# EAGLE design main_board (EAGLE 5.10)
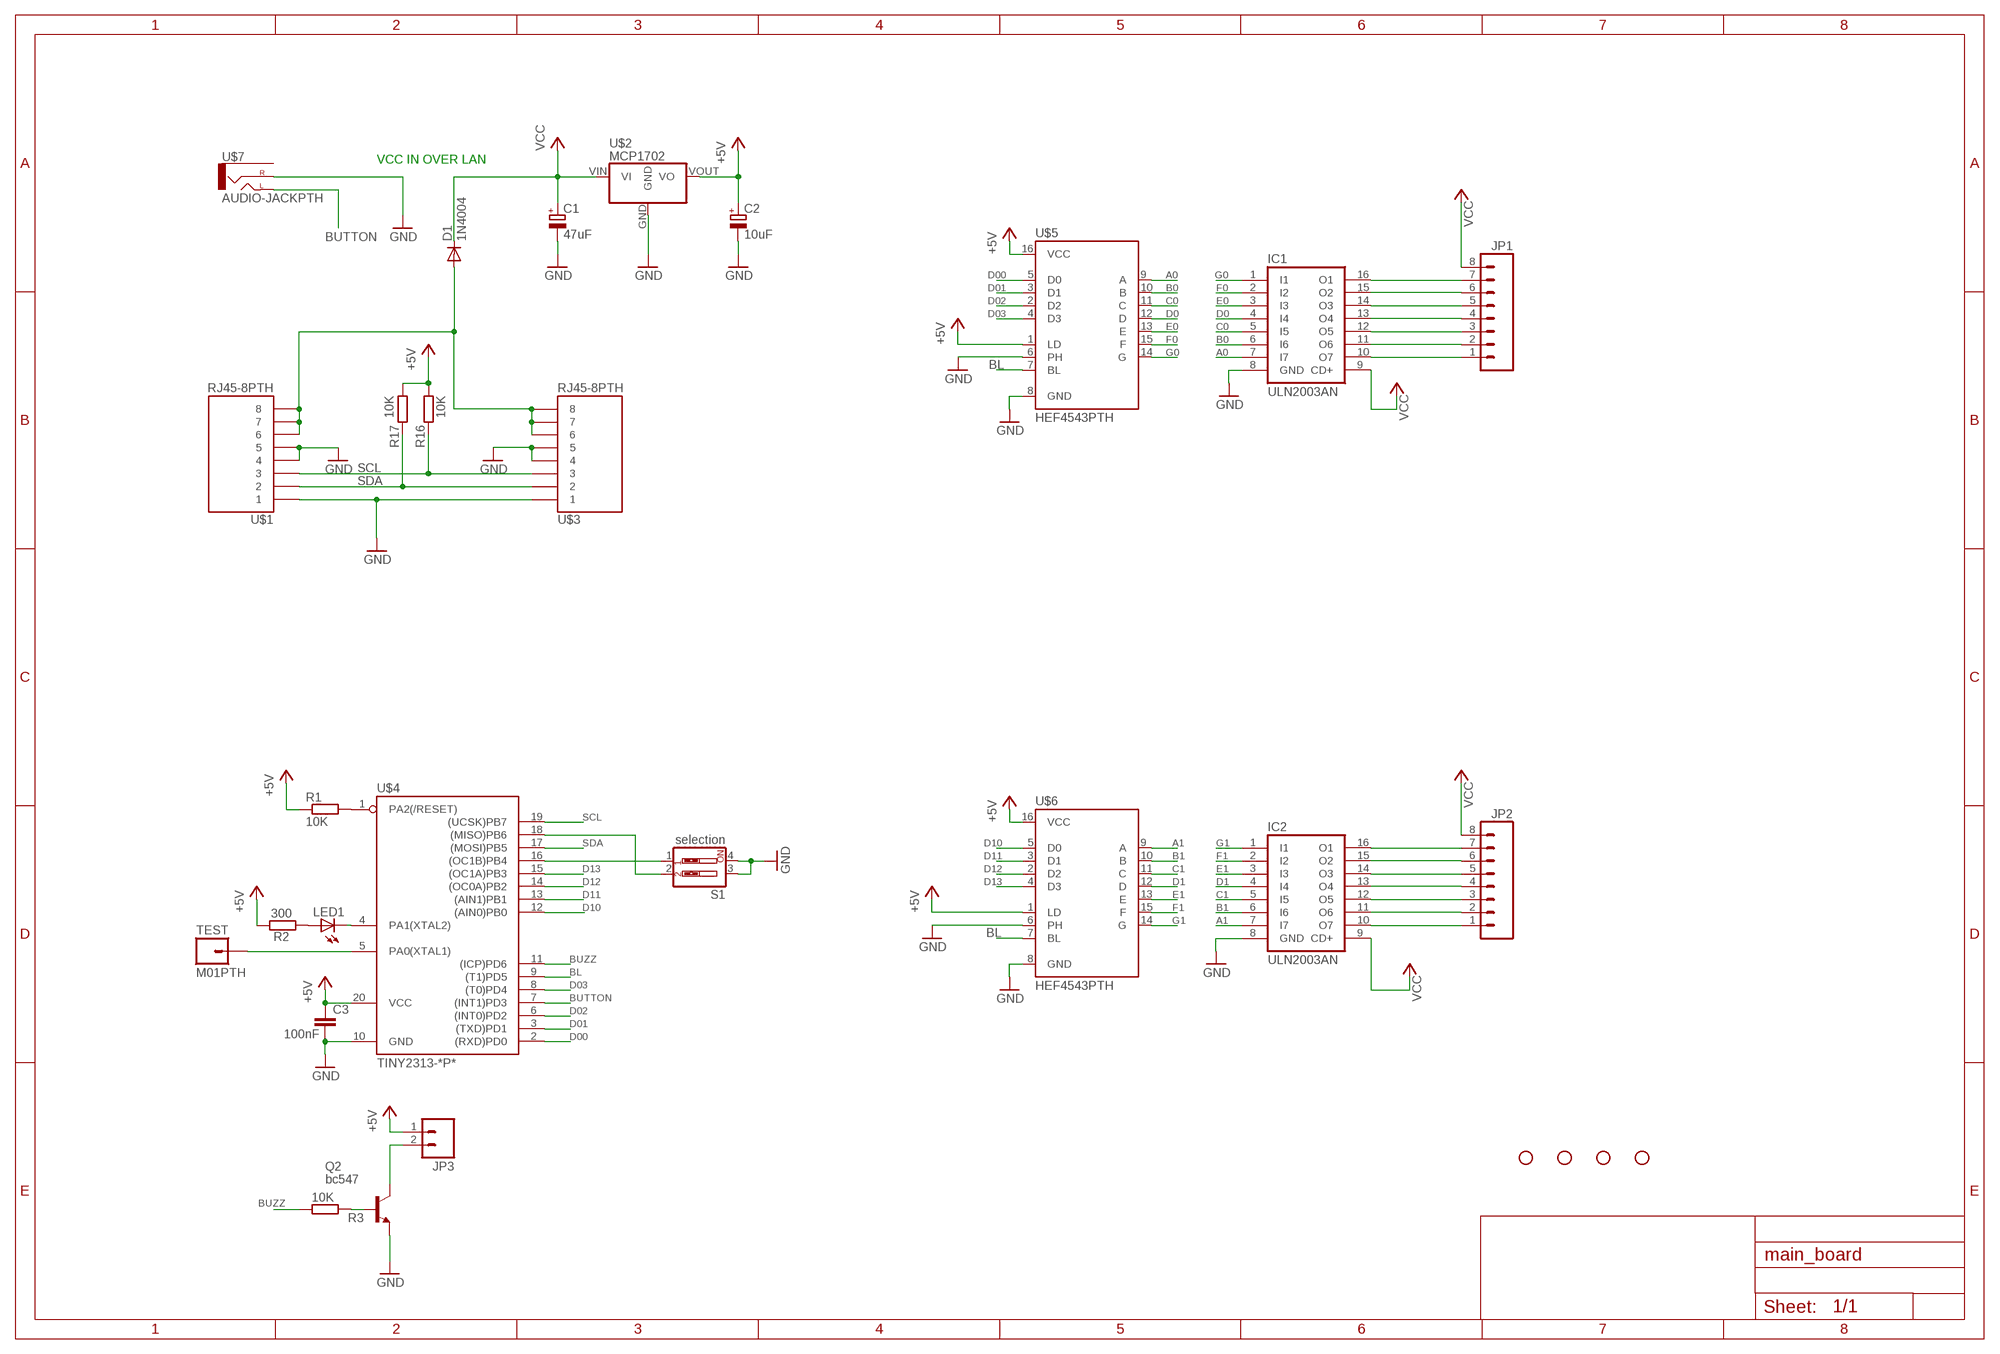
[diagram p0: schematic, sheet 1]

## Parts
C1  47uF  CPOL-EUE2-5  [E2-5]
C2  10uF  CPOL-EUE2-5  [E2-5]
C3  100nF  C-EU025-024X044  [C025-024X044]
D1  1N4004  [DO41-10]
IC1  ULN2003AN  [DIL16]
IC2  ULN2003AN  [DIL16]
JP1  M08  [1X08]
JP2  M08  [1X08]
JP3  M02  [1X02_LONGPADS]
JP4  STAND-OFF  [STAND-OFF]
JP5  STAND-OFF  [STAND-OFF]
JP6  STAND-OFF  [STAND-OFF]
JP7  STAND-OFF  [STAND-OFF]
LED1  LED5MM  [LED5MM]
Q2  bc547  BC547  [TO92]
R1  10K  R-EU_0207/7  [0207/7]
R2  300  R-EU_0207/7  [0207/7]
R3  10K  R-EU_0207/7  [0207/7]
R16  10K  R-EU_0207/7  [0207/7]
R17  10K  R-EU_0207/7  [0207/7]
S1  selection  SW_DIP-2  [DIPSWITCH-02]
TEST  M01PTH  [1X01]
U$1  RJ45-8PTH  [RJ45-8]
U$2  MCP1702  [TO-92-3]
U$3  RJ45-8PTH  [RJ45-8]
U$4  TINY2313-*P*  [DIL20]
U$5  HEF4543PTH  [DIL16]
U$6  HEF4543PTH  [DIL16]
U$7  AUDIO-JACKPTH  [AUDIO-JACK]

## Nets
+5V [power]: C2.+ C3.1 JP3.1 R1.1 R2.1 R16.2 R17.1 U$2.VOUT(VO) U$4.20(VCC) U$5.1(LD) U$5.16(VCC) U$6.1(LD) U$6.16(VCC)
A0: IC1.7(I7) U$5.9(A)
A1: IC2.7(I7) U$6.9(A)
B0: IC1.6(I6) U$5.10(B)
B1: IC2.6(I6) U$6.10(B)
BL: U$4.9((T1)PD5) U$5.7(BL) U$6.7(BL)
BUTTON [communication]: U$4.7((INT1)PD3) U$7.TIP(LEFT)
BUZZ: R3.2 U$4.11((ICP)PD6)
C0: IC1.5(I5) U$5.11(C)
C1: IC2.5(I5) U$6.11(C)
D00 [power]: U$4.2((RXD)PD0) U$5.5(D0)
D0: IC1.4(I4) U$5.12(D)
D01 [power]: U$4.3((TXD)PD1) U$5.3(D1)
D1: IC2.4(I4) U$6.12(D)
D02 [power]: U$4.6((INT0)PD2) U$5.2(D2)
D03 [power]: U$4.8((T0)PD4) U$5.4(D3)
D10 [power]: U$4.12((AIN0)PB0) U$6.5(D0)
D11 [power]: U$4.13((AIN1)PB1) U$6.3(D1)
D12 [power]: U$4.14((OC0A)PB2) U$6.2(D2)
D13 [power]: U$4.15((OC1A)PB3) U$6.4(D3)
E0: IC1.3(I3) U$5.13(E)
E1: IC2.3(I3) U$6.13(E)
F0: IC1.2(I2) U$5.15(F)
F1: IC2.2(I2) U$6.15(F)
G0: IC1.1(I1) U$5.14(G)
G1: IC2.1(I1) U$6.14(G)
GND [power]: C1.- C2.- C3.2 IC1.8(GND) IC2.8(GND) Q2.1(E) S1.3 S1.4 U$1.1 U$1.4 U$1.5 U$2.GND U$3.1 U$3.4 U$3.5 U$4.10(GND) U$5.6(PH) U$5.8(GND) U$6.6(PH) U$6.8(GND) U$7.RING(RIGHT)
N$1: LED1.K(C) U$4.4(PA1(XTAL2))
N$2: D1.A U$1.6 U$1.7 U$1.8 U$3.6 U$3.7 U$3.8
N$3: TEST.1 U$4.5(PA0(XTAL1))
N$4: LED1.A R2.2
N$5: R1.2 U$4.1(PA2(/RESET))
N$6: S1.1 U$4.16((OC1B)PB4)
N$7: S1.2 U$4.18((MISO)PB6)
N$20: IC1.16(O1) JP1.7
N$21: IC1.15(O2) JP1.6
N$22: IC1.14(O3) JP1.5
N$23: IC1.13(O4) JP1.4
N$24: IC1.12(O5) JP1.3
N$25: IC1.11(O6) JP1.2
N$26: IC1.10(O7) JP1.1
N$27: IC2.16(O1) JP2.7
N$28: IC2.15(O2) JP2.6
N$29: IC2.14(O3) JP2.5
N$30: IC2.13(O4) JP2.4
N$31: IC2.12(O5) JP2.3
N$32: IC2.11(O6) JP2.2
N$33: IC2.10(O7) JP2.1
N$34 [power]: JP3.2 Q2.3(C)
N$36: Q2.2(B) R3.1
SCL [communication]: R16.1 U$1.3 U$3.3 U$4.19((UCSK)PB7)
SDA [communication]: R17.2 U$1.2 U$3.2 U$4.17((MOSI)PB5)
VCC [power]: C1.+ D1.C IC1.9(CD+) IC2.9(CD+) JP1.8 JP2.8 U$2.VIN(VI)
Unconnected: U$7.SLEEVE

## Notes on the sheet
- VCC IN OVER LAN

## Library data of the parts
C1 C2 = rcl:CPOL-EU: POLARIZED CAPACITOR, European symbol
C3 = rcl:C-EU: CAPACITOR, European symbol
D1 = diode:1N4004: DIODE general purpose rectifier, 1 A
IC1 IC2 = uln-udn:ULN2003A: DRIVER ARRAY
JP1 JP2 = SparkFun:M08: Header 8 Standard 8-pin 0.1" header. Use with straight break away headers (SKU : PRT-00116), right angle break away headers (PRT-00553), swiss pins (PRT-00743), machine pins (PRT-00117), and female headers (PRT-00115).
JP3 = SparkFun:M02: Header 2 Standard 2-pin 0.1" header. Use with straight break away headers (SKU : PRT-00116), right angle break away headers (PRT-00553), swiss pins (PRT-00743), machine pins (PRT-00117), and female headers (PRT-00115). Molex polarized connector foot print use with SKU : PRT-08233 with associated crimp pins and housings.
JP4-JP7 = SparkFun:STAND-OFF: Stand Off This is the mechanical footprint for a #4 phillips button head screw. Use the keepout ring to avoid running the screw head into surrounding components. SKU : PRT-00447
LED1 = led:LED: LED OSRAM: - CHIPLED LG R971, LG N971, LY N971, LG Q971, LY Q971, LO R971, LY R971 LH N974, LH R974 LS Q976, LO Q976, LY Q976 LO Q996 - Hyper CHIPLED LW Q18S LB Q993, LB Q99A, LB R99A - SideLED LS A670, LO A670, LY A670, LG A670, LP A670 LB A673, LV A673, LT A673, LW A673 LH A674 LY A675 LS A676, LA A676, LO A676, LY A676, LW A676 LS A679, LY A679, LG A679 - Hyper Micro SIDELED® LS Y876, LA Y876, LO Y876, LY Y876 LT Y87S - SmartLED LW L88C, LW L88S LB L89C, LB L89S, LG L890 LS L89K, LO L89K, LY L89K LS L896, LA L896, LO L896, LY L896 - TOPLED LS T670, LO T670, LY T670, LG T670, LP T670 LSG T670, LSP T670, LSY T670, LOP T670, LYG T670 LG T671, LOG T671, LSG T671 LB T673, LV T673, LT T673, LW T673 LH T674 LS T676, LA T676, LO T676, LY T676, LB T676, LH T676, LSB T676, LW T676 LB T67C, LV T67C, LT T67C, LS T67K, LO T67K, LY T67K, LW E67C LS E67B, LA E67B, LO E67B, LY E67B, LB E67C, LV E67C, LT E67C LW T67C LS T679, LY T679, LG T679 LS T770, LO T770, LY T770, LG T770, LP T770 LB T773, LV T773, LT T773, LW T773 LH T774 LS E675, LA E675, LY E675, LS T675 LS T776, LA T776, LO T776, LY T776, LB T776 LHGB T686 LT T68C, LB T68C - Hyper Mini TOPLED® LB M676 - Mini TOPLED Santana® LG M470 LS M47K, LO M47K, LY M47K Source: http://www.osram.convergy.de LUXEON: - LUMILED® LXK2-PW12-R00, LXK2-PW12-S00, LXK2-PW14-U00, LXK2-PW14-V00 LXK2-PM12-R00, LXK2-PM12-S00, LXK2-PM14-U00 LXK2-PE12-Q00, LXK2-PE12-R00, LXK2-PE12-S00, LXK2-PE14-T00, LXK2-PE14-U00 LXK2-PB12-K00, LXK2-PB12-L00, LXK2-PB12-M00, LXK2-PB14-N00, LXK2-PB14-P00, LXK2-PB14-Q00 LXK2-PR12-L00, LXK2-PR12-M00, LXK2-PR14-Q00, LXK2-PR14-R00 LXK2-PD12-Q00, LXK2-PD12-R00, LXK2-PD12-S00 LXK2-PH12-R00, LXK2-PH12-S00 LXK2-PL12-P00, LXK2-PL12-Q00, LXK2-PL12-R00 Source: www.luxeon.com KINGBRIGHT: KA-3528ASYC Source: www.kingbright.com
Q2 = transistor:BC547: NPN TRANSISTOR
R1 = rcl:R-EU_: RESISTOR, European symbol
R2 R3 R16 R17 = resistor:R-EU_: RESISTOR, European symbol
S1 = SparkFun:SW_DIP-2: DIP SWITCH
TEST = SparkFun:M01: Header 1 Standard 1-pin 0.1" header. Use with straight break away headers (SKU : PRT-00116), right angle break away headers (PRT-00553), swiss pins (PRT-00743), machine pins (PRT-00117), and female headers (PRT-00115).
U$1 U$3 = SparkFun:RJ45-8: RJ45 Jack Simple RJ45, 8-pin connection - connector for common Cat5, Cat5e, and Cat6 Ethernet cables. Footprint not yet proven in production. Connector sku is PRT-00643; Breakout PCB sku is BOB-00716.
U$2 = my-components:MCP1702: The MCP1702 is a family of CMOS low dropout (LDO), positive voltage regulators that can deliver up to 250 mA of current while consuming only 2.0 ?A of quiescent current (typ.).
U$4 = avr-7:TINY2313*: Atmel Tiny2313 2K Flash, 128 bytes EEPROM, 128 bytes RAM
U$5 U$6 = SparkFun:HEF4543
U$7 = SparkFun:AUDIO-JACK: 3.5mm Audio Jack Simple 3.5mm common PCB mount audio jack. SKU: PRT-08032

## Net classes
1 power: width 0.406 mm, clearance 0.305 mm
2 communication: width 0.305 mm, clearance 0.305 mm

## Board
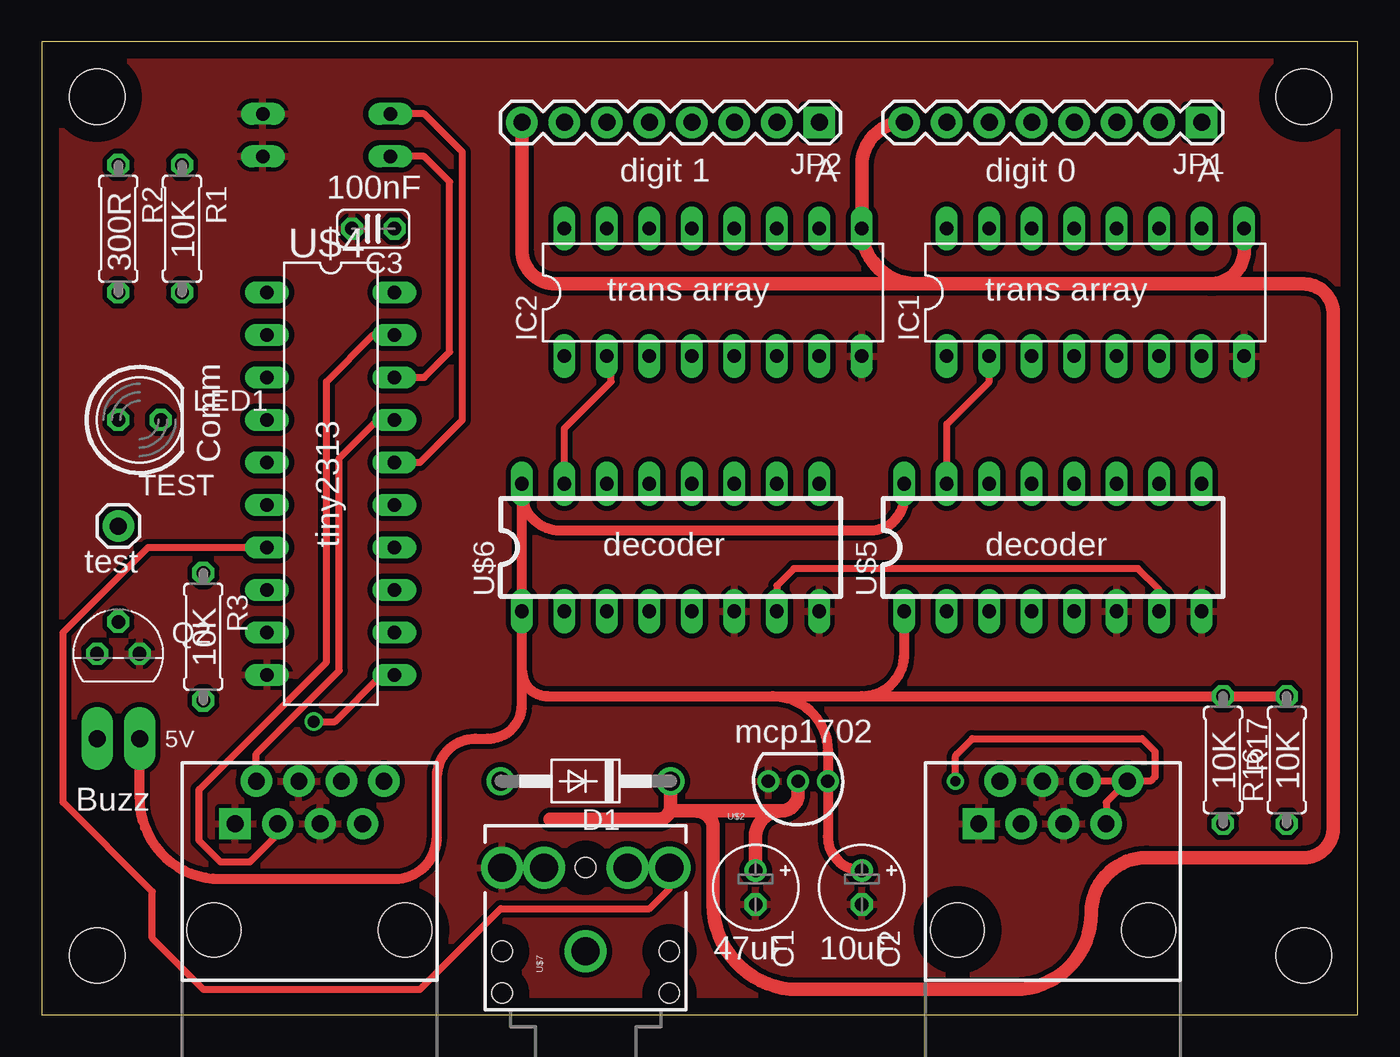
[diagram p1: board, top side]
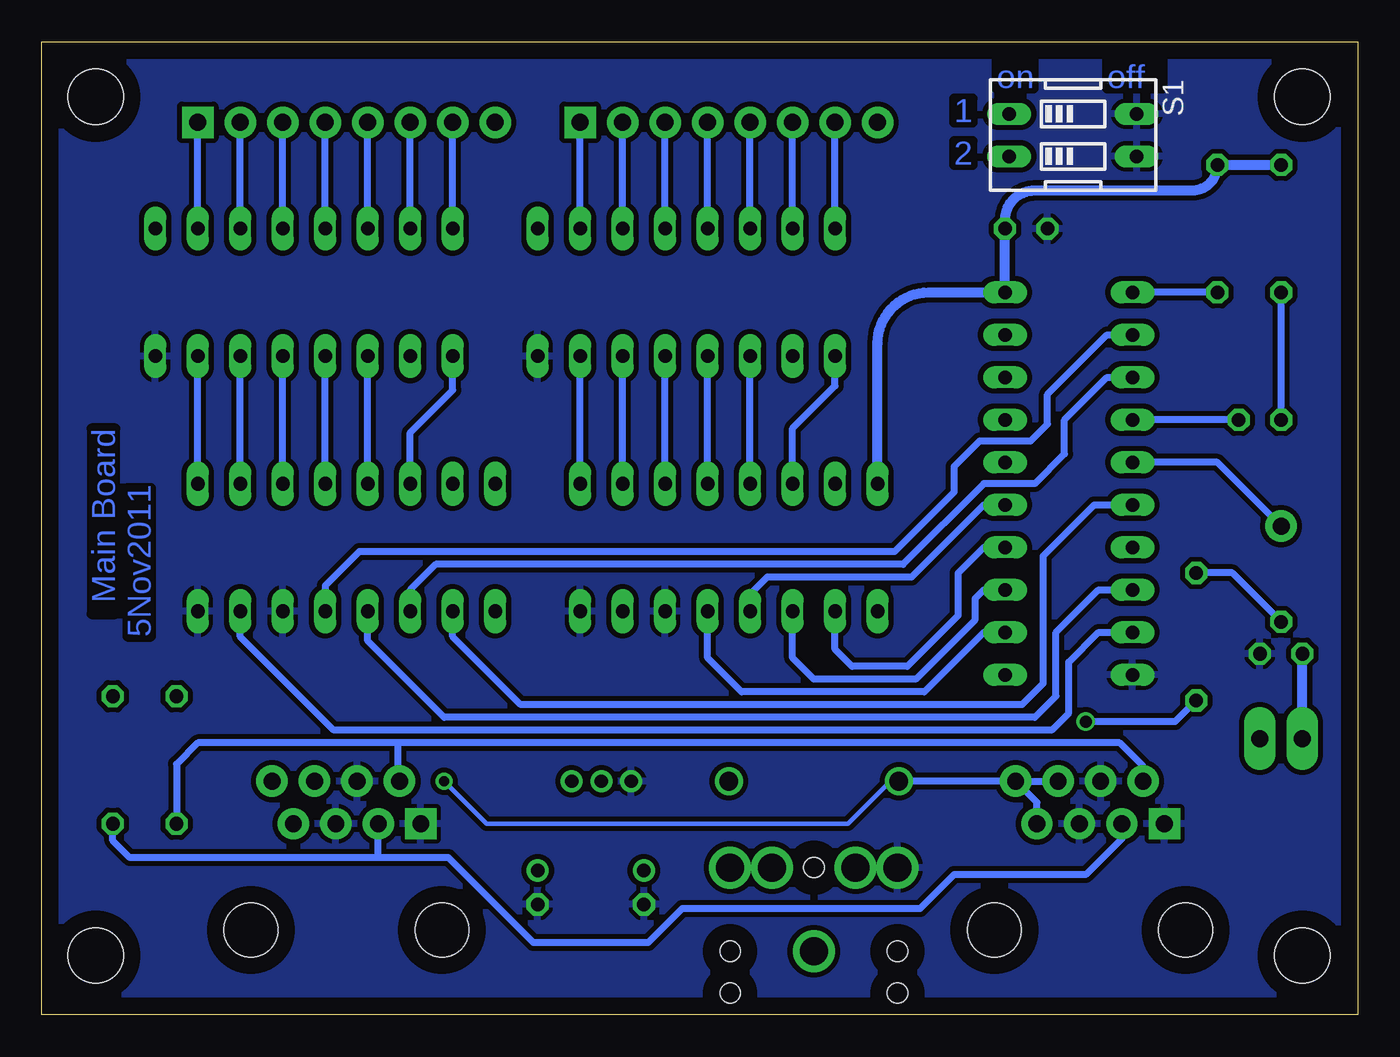
[diagram p2: board, bottom side, seen from below]

Size 78.66 x 58.16 mm. Coordinates in mm from the lower left corner, seen from the top.
Outline: 0,0 78.66,0 78.66,58.16 0,58.16 0,0
Copper layers (1*16): Top 0.035mm / dielectric 1.5mm / Bottom 0.035mm
Design rules "default *": minimum track width 10mil, minimum drill 24mil, track to track 8mil, track to pad 8mil, pad to pad 8mil, via to via 8mil, smd to smd 8mil, copper to edge 40mil, drill to drill 8mil, minimum pad ring 10mil, minimum via ring 8mil, stop-mask expansion 4mil, vias tented up to drill 0mil, thermal gap 10mil

### Footprints (pad centres in the part's own frame; a part is rotated, then mirrored left to right if it is on the bottom)
E2-5 = drill 0.813 pad 1.27 round: + -1.016,0 | drill 0.813 pad 1.27 octagon: - 1.016,0
C025-024X044 = drill 0.813 octagon: 1 -1.27,0; 2 1.27,0
DO41-10 = drill 1.118 round: A 5.08,0; C -5.08,0
DIL16 = drill 0.813 long: 1 -8.89,-3.81; 2 -6.35,-3.81; 3 -3.81,-3.81; 4 -1.27,-3.81; 5 1.27,-3.81; 6 3.81,-3.81; 7 6.35,-3.81; 8 8.89,-3.81; 9 8.89,3.81; 10 6.35,3.81; 11 3.81,3.81; 12 1.27,3.81; 13 -1.27,3.81; 14 -3.81,3.81; 15 -6.35,3.81; 16 -8.89,3.81
1X08 = drill 1.016 pad 1.88 square: 1 0,0 | drill 1.016 pad 1.88 round: 2 2.54,0; 3 5.08,0; 4 7.62,0; 5 10.16,0; 6 12.7,0; 7 15.24,0; 8 17.78,0
1X02_LONGPADS = drill 1.016 pad 1.88 long: 1 0,0; 2 2.54,0
STAND-OFF = hole 3.302: 0,0
LED5MM = drill 0.813 octagon: A -1.27,0; K 1.27,0
TO92 = drill 0.813 octagon: 1 1.27,0; 2 0,1.905; 3 -1.27,0
0207/7 = drill 0.813 octagon: 1 -3.81,0; 2 3.81,0
DIPSWITCH-02 = drill 0.813 long: 1 -1.27,-3.81; 2 1.27,-3.81; 3 1.27,3.81; 4 -1.27,3.81
1X01 = drill 1.016 pad 1.88 round: 1 0,0
RJ45-8 = drill 1 pad 1.88 square: 1 -4.445,6.35 | drill 1 pad 1.88 round: 2 -3.175,8.89; 3 -1.905,6.35; 4 -0.635,8.89; 5 0.635,6.35; 6 1.905,8.89; 7 3.175,6.35; 8 4.445,8.89 | hole 3.2: -5.715,0; 5.715,0
TO-92-3 = drill 0.8 pad 1.016 round: GND 1.778,0; VIN 0,0; VOUT -1.778,0
DIL20 = drill 0.813 long: 1 -11.43,-3.81; 2 -8.89,-3.81; 3 -6.35,-3.81; 4 -3.81,-3.81; 5 -1.27,-3.81; 6 1.27,-3.81; 7 3.81,-3.81; 8 6.35,-3.81; 9 8.89,-3.81; 10 11.43,-3.81; 11 11.43,3.81; 12 8.89,3.81; 13 6.35,3.81; 14 3.81,3.81; 15 1.27,3.81; 16 -1.27,3.81; 17 -3.81,3.81; 18 -6.35,3.81; 19 -8.89,3.81; 20 -11.43,3.81
AUDIO-JACK = drill 1.676 pad 1.93 round: RING 5,5; TIP 5,-5 | drill 1.676 pad 1.778 round: RSH 5,2.5; TSH 5,-2.5 | drill 1.676 pad 2.184 round: SLEEVE 0,0 | hole 1.2: 0,5; -2.5,5; -2.5,-5; 0,-5; 5,0

### Placement (x,y rotation side)
C1  42.67,7.62 270 top
C2  49.02,7.62 270 top
C3  19.81,46.99 180 top
D1  32.51,13.97 180 top
IC1  62.99,43.18 0 top
IC2  40.13,43.18 0 top
JP1  69.34,53.34 180 top
JP2  46.48,53.34 180 top
JP3  5.84,16.51 180 top
JP4  3.3,54.86 0 top
JP5  75.44,54.86 0 top
JP6  75.44,3.56 0 top
JP7  3.3,3.56 0 top
LED1  5.84,35.56 0 top
Q2  4.57,21.59 0 top
R1  8.38,46.99 270 top
R2  4.57,46.99 270 top
R3  9.65,22.61 270 top
R16  74.42,15.24 90 top
R17  70.61,15.24 270 top
S1  17.02,52.58 270 bottom
TEST  4.57,29.21 0 top
U$1  60.45,5.08 0 top
U$2  45.21,13.97 180 top
U$3  16,5.08 0 top
U$4  17.27,31.75 270 top
U$5  60.45,27.94 0 top
U$6  37.59,27.94 0 top
U$7  32.51,3.81 90 top

### Tracks (layer width: path | path; a pad name or v marks a point on that pad's centre or on a via)
+5V
  Top 0.61: C2.+ arc-90 46.99,10.67 U$2.VOUT 46.99,15.75 arc90 43.69,19.05 | R16.2 R17.1 49.02,19.05 | 28.7,20.57 U$6.1 28.7,31.24 | 28.7,20.57 arc90 30.23,19.05 43.69,19.05 | 43.69,19.05 49.02,19.05 | 49.02,19.05 arc90 51.56,21.59 U$5.1 | 28.7,20.57 28.7,18.54 arc-90 26.67,16.51 25.91,16.51 arc90 23.62,14.22 23.62,10.67 arc-90 21.08,8.13 10.67,8.13 arc-90 5.84,12.95 JP3.1 | 28.7,31.24 arc90 30.99,28.96 49.53,28.96 arc90 51.56,30.99 U$5.16 | 28.7,31.24 U$6.16
  Bottom 0.61: R2.1 R1.1 arc90 9.91,49.28 19.3,49.28 arc-90 21.08,47.5 C3.1 U$4.20 25.65,43.18 arc-90 28.7,40.13 U$6.16
A0
  Bottom 0.406: U$5.9 IC1.7
A1
  Bottom 0.406: U$6.9 IC2.7
B0
  Bottom 0.406: U$5.10 IC1.6
B1
  Bottom 0.406: U$6.10 IC2.6
BL
  Top 0.406: U$6.7 43.94,25.65 44.96,26.67 65.53,26.67 66.8,25.4 U$5.7
  Bottom 0.406: U$5.7 66.8,22.61 61.21,17.02 18.29,17.02 17.27,18.03 17.27,21.08 15.49,22.86 U$4.9
BUTTON
  Top 0.406: U$4.7 6.35,27.94 1.27,22.86 1.27,12.7 6.6,7.37 6.6,4.57 9.65,1.52 22.61,1.52 27.43,6.35 36.32,6.35 37.51,7.54 U$7.TIP
BUZZ  (via drill 0.7)
  Top 0.406: U$4.11 20.32,20.32 17.53,17.53 v16.26,17.53
  Bottom 0.406: v16.26,17.53 10.92,17.53 R3.2
C0
  Bottom 0.406: U$5.11 IC1.5
C1
  Bottom 0.406: U$6.11 IC2.5
D00
  Bottom 0.406: U$4.2 14.99,40.64 18.54,37.08 18.54,35.31 19.56,34.29 22.61,34.29 24.13,32.77 24.13,31.24 27.69,27.69 59.69,27.69 61.72,25.65 U$5.5
D0
  Bottom 0.406: U$5.12 IC1.4
D01
  Bottom 0.406: U$4.3 14.99,38.1 17.53,35.56 17.53,33.53 19.3,31.75 22.35,31.75 27.18,26.92 55.12,26.92 56.64,25.4 U$5.3
D1
  Bottom 0.406: U$6.12 IC2.4
D02
  Bottom 0.406: U$5.2 54.1,22.61 50.04,18.54 20.07,18.54 18.8,19.81 18.8,27.43 15.75,30.48 U$4.6
D03
  Bottom 0.406: U$5.4 59.18,22.35 54.61,17.78 19.3,17.78 18.03,19.05 18.03,22.86 15.49,25.4 U$4.8
D10
  Bottom 0.406: U$6.5 38.86,21.34 36.83,19.3 25.91,19.3 22.35,22.86 U$4.12
D11
  Bottom 0.406: U$6.3 33.78,21.34 32.51,20.07 26.42,20.07 22.86,23.62 22.86,24.89 22.35,25.4 U$4.13
D12
  Bottom 0.406: U$6.2 31.24,21.84 30.23,20.83 26.92,20.83 23.88,23.88 23.88,26.42 22.35,27.94 U$4.14
D13
  Bottom 0.406: U$4.15 22.35,30.48 26.67,26.16 35.31,26.16 36.32,25.15 U$6.4
E0
  Bottom 0.406: U$5.13 IC1.3
E1
  Bottom 0.406: U$6.13 IC2.3
F0
  Top 0.406: U$5.15 54.1,35.31 56.64,37.85 IC1.2
F1
  Top 0.406: U$6.15 31.24,35.05 34.04,37.85 34.04,39.12 IC2.2
G0
  Bottom 0.406: U$5.14 56.64,34.8 54.1,37.34 IC1.1
G1
  Bottom 0.406: U$6.14 33.78,35.05 31.24,37.59 IC2.1
GND
  pour Bottom (isolate 0.305): -5.08,68.58 91.44,68.58 91.44,-7.62 -5.08,-7.62
  pour Top: -15.24,76.2 101.6,76.2 101.6,-15.24 -15.24,-15.24
N$1
  Bottom 0.406: LED1.K U$4.4
N$2  (via drill 0.61)
  Top 0.406: v54.61,13.97 54.61,15.36 arc-45 54.7,15.59 55.63,16.51 65.79,16.51 66.55,15.75 66.55,14.22 66.29,13.97 U$1.8 | U$1.8 U$1.6 | U$1.7 63.63,12.7 U$1.8
  Bottom 0.254: v54.61,13.97 52.07,11.43 30.48,11.43 27.94,13.97 D1.A
  Bottom 0.406: U$3.8 D1.A | U$3.8 U$3.6 | U$3.7 19.18,12.7 U$3.8
N$3
  Bottom 0.406: TEST.1 8.38,33.02 U$4.5
N$4
  Bottom 0.406: LED1.A R2.2
N$5
  Bottom 0.406: R1.2 U$4.1
N$6
  Top 0.406: U$4.16 22.61,33.02 25.15,35.56 25.15,51.56 22.86,53.85 S1.1
N$7
  Top 0.406: U$4.18 22.86,38.1 24.38,39.62 24.38,49.78 22.86,51.31 S1.2
N$20
  Bottom 0.406: IC1.16 JP1.7
N$21
  Bottom 0.406: IC1.15 JP1.6
N$22
  Bottom 0.406: IC1.14 JP1.5
N$23
  Bottom 0.406: IC1.13 JP1.4
N$24
  Bottom 0.406: IC1.12 JP1.3
N$25
  Bottom 0.406: IC1.11 JP1.2
N$26
  Bottom 0.406: IC1.10 JP1.1
N$27
  Bottom 0.406: IC2.16 JP2.7
N$28
  Bottom 0.406: IC2.15 JP2.6
N$29
  Bottom 0.406: IC2.14 JP2.5
N$30
  Bottom 0.406: IC2.13 JP2.4
N$31
  Bottom 0.406: IC2.12 JP2.3
N$32
  Bottom 0.406: IC2.11 JP2.2
N$33
  Bottom 0.406: IC2.10 JP2.1
N$34
  Bottom 0.61: JP3.2 Q2.3
N$36
  Bottom 0.406: Q2.2 7.49,26.42 R3.1
SCL
  Top 0.406: U$3.3 14.1,10.79 12.45,9.14 10.67,9.14 9.4,10.41 9.4,13.46 17.02,21.08 17.02,37.85 19.81,40.64 U$4.19
  Bottom 0.406: R16.1 74.42,10.41 73.41,9.4 58.67,9.4 | 58.67,9.4 54.36,9.4 49.28,4.32 42.42,4.32 40.39,6.35 26.16,6.35 24.13,8.38 16.26,8.38 14.1,10.54 U$3.3 | U$1.3 58.55,9.53 58.67,9.4
SDA
  Top 0.406: U$4.17 20.07,35.56 17.78,33.27 17.78,20.57 12.83,15.62 U$3.2
  Bottom 0.406: R17.2 70.61,14.99 69.34,16.26 57.4,16.26 | U$3.2 12.83,14.86 14.22,16.26 57.4,16.26 | U$1.2 57.4,14.1 57.4,16.26
VCC
  Top 0.813: 39.12,12.19 44.2,12.19 | 44.2,12.19 arc90 45.21,13.21 U$2.VIN | 44.2,12.19 arc90 42.67,10.67 C1.+ | IC1.9 71.88,45.72 arc-90 69.85,43.69 | 69.85,43.69 52.32,43.69 | 52.32,43.69 arc-90 IC2.9 49.02,50.8 arc-90 JP1.8 | JP2.8 28.7,45.72 arc90 30.73,43.69 52.32,43.69 | 69.85,43.69 75.44,43.69 arc-90 77.22,41.91 77.22,11.18 arc-90 75.44,9.4 66.04,9.4 arc90 62.74,6.1 arc-90 58.17,1.52 45.21,1.52 arc-90 40.13,6.6 40.13,11.18 arc90 39.12,12.19 | 39.12,12.19 37.85,12.19 arc-90 37.59,12.45 | 37.59,12.45 D1.C | 37.59,12.45 arc-90 36.83,11.68 30.39,11.68

### Text on the board
Bottom: off | on | 1 | 2 | Main Board | 5Nov2011
tPlace: digit 1 | A | digit 0 | A | 100nF | 10K | 300R | trans array | trans array | Comm | tiny2313 | decoder | decoder | test | 10K | 5V | mcp1702 | 10K | 10K | Buzz | 47uF | 10uF